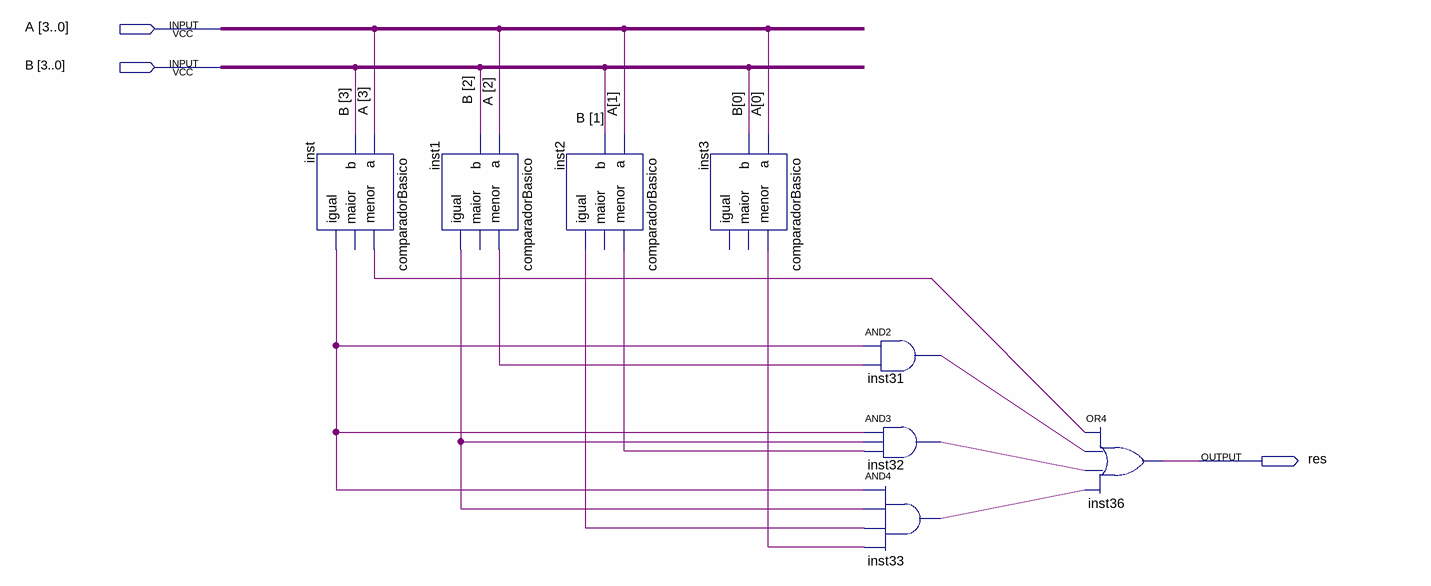
[diagram p0: schematic sheet]
// Quartus schematic menorModulo.bdf as structural Verilog: 8 symbols, 3 pins
module menorModulo (
  input  [3:0] A,
  input  [3:0] B,
  output res
);

  wire inst1_igual, inst1_menor, inst2_igual, inst2_menor, inst3_menor, inst31_out, inst32_out, inst33_out,
       inst_igual, inst_menor;

  comparadorBasico inst (.a(A[3]), .b(B[3]), .menor(inst_menor), .igual(inst_igual));  // open: maior
  comparadorBasico inst1 (.a(A[2]), .b(B[2]), .menor(inst1_menor), .igual(inst1_igual));  // open: maior
  comparadorBasico inst2 (.a(A[1]), .b(B[1]), .menor(inst2_menor), .igual(inst2_igual));  // open: maior
  comparadorBasico inst3 (.a(A[0]), .b(B[0]), .menor(inst3_menor));  // open: maior, igual
  and inst31 (inst31_out, inst_igual, inst1_menor);
  and inst32 (inst32_out, inst_igual, inst1_igual, inst2_menor);
  and inst33 (inst33_out, inst_igual, inst1_igual, inst2_igual, inst3_menor);
  or inst36 (res, inst_menor, inst31_out, inst32_out, inst33_out);
endmodule
